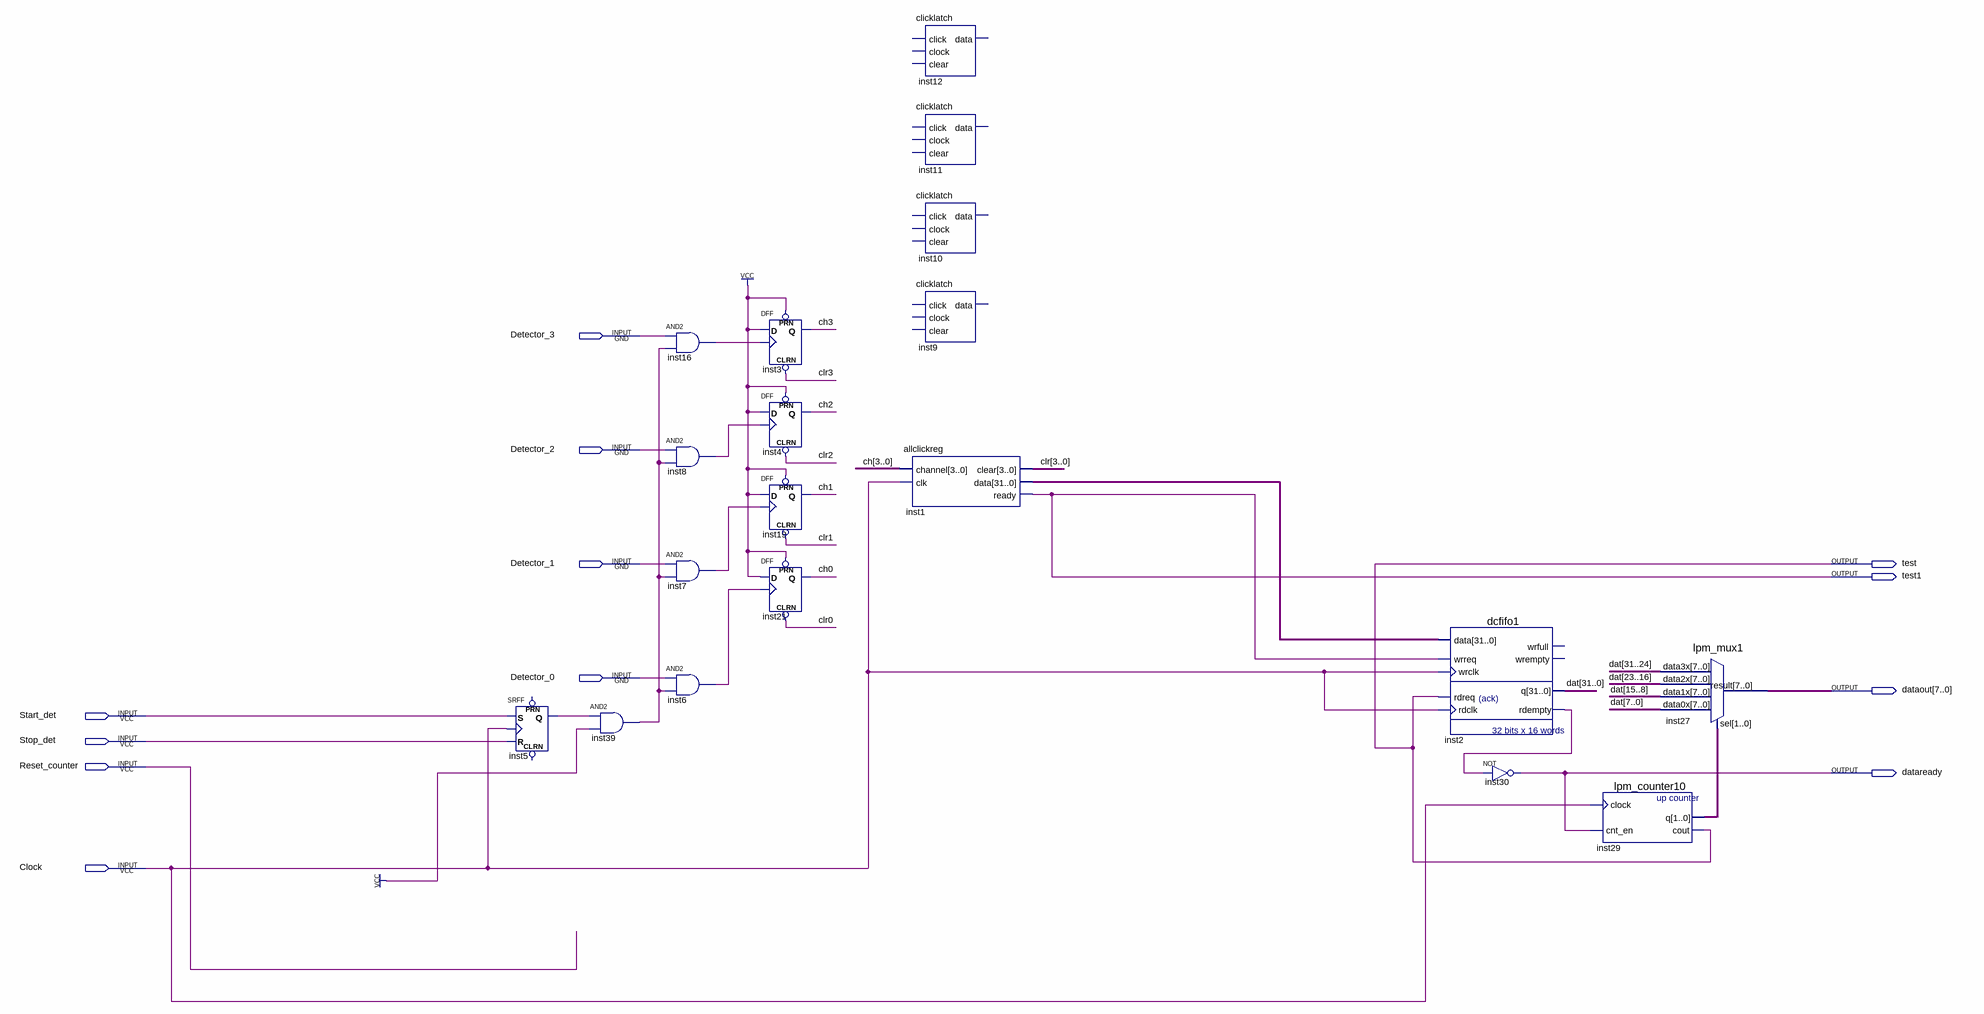
[diagram p0: schematic sheet]
// Quartus schematic apdtimer_all_bkup.bdf as structural Verilog: 19 symbols, 12 pins
module apdtimer_all_bkup (
  input  Detector_3,
  input  Detector_2,
  input  Detector_1,
  input  Detector_0,
  input  Start_det,
  input  Stop_det,
  input  Reset_counter,
  input  Clock,
  output test,
  output test1,
  output [7:0] dataout,
  output dataready
);

  wire inst2_rdempty, inst5_q, inst6_out, inst7_out, inst8_out, inst16_out, inst39_out;
  wire [1:0] inst29_q;
  wire [3:0] ch, clr;
  wire [31:0] dat, inst1_data;

  SRFF inst5 (.S(Start_det), .R(Stop_det), .CLK(Clock), .Q(inst5_q));  // open: PRN, CLRN
  and inst39 (inst39_out, inst5_q, 1'b1);
  and inst16 (inst16_out, Detector_3, inst39_out);
  and inst8 (inst8_out, Detector_2, inst39_out);
  and inst7 (inst7_out, Detector_1, inst39_out);
  and inst6 (inst6_out, Detector_0, inst39_out);
  DFF inst3 (.CLRN(clr[3]), .CLK(inst16_out), .D(1'b1), .PRN(1'b1), .Q(ch[3]));
  DFF inst4 (.CLRN(clr[2]), .CLK(inst8_out), .D(1'b1), .PRN(1'b1), .Q(ch[2]));
  DFF inst19 (.CLRN(clr[1]), .CLK(inst7_out), .D(1'b1), .PRN(1'b1), .Q(ch[1]));
  DFF inst21 (.CLRN(clr[0]), .CLK(inst6_out), .D(1'b1), .PRN(1'b1), .Q(ch[0]));
  clicklatch inst12 ();  // open: click, clock, clear, data
  clicklatch inst11 ();  // open: click, clock, clear, data
  clicklatch inst10 ();  // open: click, clock, clear, data
  clicklatch inst9 ();  // open: click, clock, clear, data
  allclickreg inst1 (.channel(ch), .clk(Clock), .clear(clr), .data(inst1_data), .ready(test1));
  dcfifo1 inst2 (
    .data(inst1_data), .wrreq(test1), .wrclk(Clock), .rdreq(test), .rdclk(Clock), .q(dat),
    .rdempty(inst2_rdempty));  // open: wrfull, wrempty
  not inst30 (dataready, inst2_rdempty);
  lpm_counter10 inst29 (.clock(Clock), .cnt_en(dataready), .q(inst29_q), .cout(test));
  lpm_mux1 inst27 (
    .data3x(dat[31:24]), .data2x(dat[23:16]), .data1x(dat[15:8]), .data0x(dat[7:0]), .sel(inst29_q),
    .result(dataout));
endmodule
